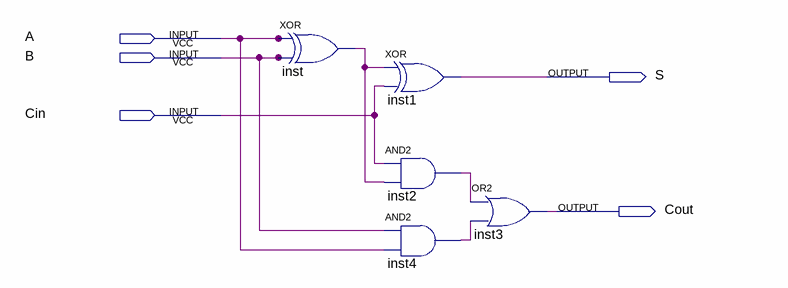
[diagram p0: schematic sheet]
// Quartus schematic FA.bdf as structural Verilog: 5 symbols, 5 pins
module FA (
  input  A,
  input  B,
  input  Cin,
  output S,
  output Cout
);

  wire inst2_out, inst4_out, inst_out;

  xor inst (inst_out, A, B);
  xor inst1 (S, inst_out, Cin);
  and inst2 (inst2_out, Cin, inst_out);
  and inst4 (inst4_out, B, A);
  or inst3 (Cout, inst2_out, inst4_out);
endmodule
